# EAGLE design PVScontroller_v1_with_logo (EAGLE 7.2.0)
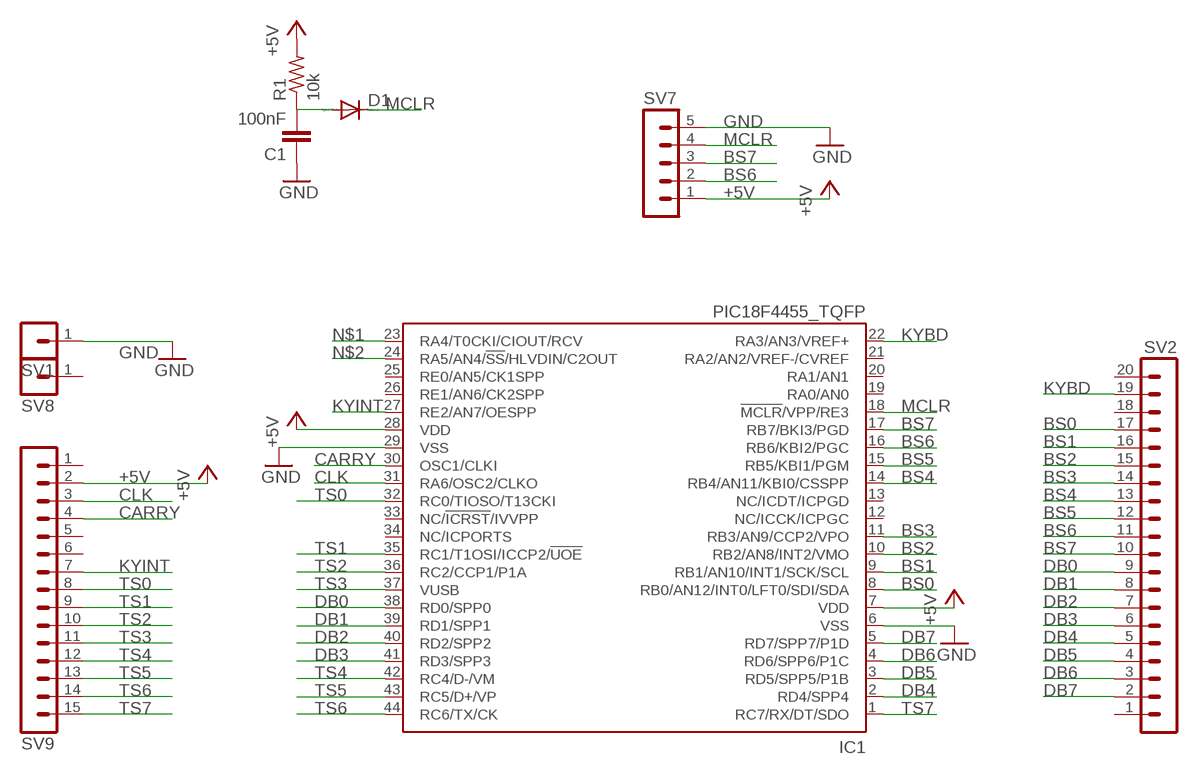
[diagram p0: schematic, sheet 1]

## Parts
C1  100nF  C-EUC0805  [C0805]
D1  DIODE-SOD80C  [SOD80C]
IC1  PIC18F4455_TQFP  [TQFP44]
R1  10k  R-US_R0805  [R0805]
SV1  MA01-1  [MA01-1]
SV2  MA20-1  [MA20-1]
SV7  MA05-1  [MA05-1]
SV8  MA01-1  [MA01-1]
SV9  MA15-1  [MA15-1]

## Nets
+5V: IC1.7(VDD) IC1.28(VDD) R1.2 SV7.1 SV9.2
BS0: IC1.8(RB0/AN12/INT0/LFT0/SDI/SDA) SV2.17
BS1: IC1.9(RB1/AN10/INT1/SCK/SCL) SV2.16
BS2: IC1.10(RB2/AN8/INT2/VMO) SV2.15
BS3: IC1.11(RB3/AN9/CCP2/VPO) SV2.14
BS4: IC1.14(RB4/AN11/KBI0/CSSPP) SV2.13
BS5: IC1.15(RB5/KBI1/PGM) SV2.12
BS6: IC1.16(RB6/KBI2/PGC) SV2.11 SV7.2
BS7: IC1.17(RB7/BKI3/PGD) SV2.10 SV7.3
CARRY: IC1.30(OSC1/CLKI) SV9.4
CLK: IC1.31(RA6/OSC2/CLKO) SV9.3
DB0: IC1.38(RD0/SPP0) SV2.9
DB1: IC1.39(RD1/SPP1) SV2.8
DB2: IC1.40(RD2/SPP2) SV2.7
DB3: IC1.41(RD3/SPP3) SV2.6
DB4: IC1.2(RD4/SPP4) SV2.5
DB5: IC1.3(RD5/SPP5/P1B) SV2.4
DB6: IC1.4(RD6/SPP6/P1C) SV2.3
DB7: IC1.5(RD7/SPP7/P1D) SV2.2
GND: C1.1 IC1.6(VSS) IC1.29(VSS) SV1.1 SV7.5
KYBD: IC1.22(RA3/AN3/VREF+) SV2.19
KYINT: IC1.27(RE2/AN7/OESPP) SV9.7
MCLR: D1.C IC1.18(!MCLR!/VPP/RE3) SV7.4
N$1: IC1.23(RA4/T0CKI/CIOUT/RCV)
N$2: IC1.24(RA5/AN4/!SS!/HLVDIN/C2OUT)
N$4: C1.2 D1.A R1.1
TS0: IC1.32(RC0/TIOSO/T13CKI) SV9.8
TS1: IC1.35(RC1/T1OSI/ICCP2/!UOE) SV9.9
TS2: IC1.36(RC2/CCP1/P1A) SV9.10
TS3: IC1.37(VUSB) SV9.11
TS4: IC1.42(RC4/D-/VM) SV9.12
TS5: IC1.43(RC5/D+/VP) SV9.13
TS6: IC1.44(RC6/TX/CK) SV9.14
TS7: IC1.1(RC7/RX/DT/SDO) SV9.15
Unconnected: IC1.12(NC/ICCK/ICPGC) IC1.13(NC/ICDT/ICPGD) IC1.19(RA0/AN0) IC1.20(RA1/AN1) IC1.21(RA2/AN2/VREF-/CVREF) IC1.25(RE0/AN5/CK1SPP) IC1.26(RE1/AN6/CK2SPP) IC1.33(NC/!ICRST!/IVVPP) IC1.34(NC/ICPORTS) SV2.1 SV2.18 SV2.20 SV8.1 SV9.1 SV9.5 SV9.6

## Library data of the parts
C1 = resistor:C-EU: CAPACITOR, European symbol
D1 = diode:DIODE-: DIODE
IC1 = microchip:PIC18F4*_TQFP: USB Microcontrollers with nanoWatt Technology High-Performance, Enhanced Flash, 28/40/44-Pin, Source: http://ww1.microchip.com/downloads/en/devicedoc/39632c.pdf; MF: MICROCHIP; MPN: PIC18F4455-I/PT; OC_FARNELL: 9321322; OC_NEWARK: 08J9628
R1 = resistor:R-US_: RESISTOR, American symbol
SV1 SV8 = joakim:MA01-1: PIN HEADER
SV2 = joakim:MA20-1: PIN HEADER; OC_FARNELL: unknown; OC_NEWARK: unknown
SV7 = joakim:MA05-1: PIN HEADER; OC_FARNELL: unknown; OC_NEWARK: unknown
SV9 = joakim:MA15-1: PIN HEADER; OC_FARNELL: unknown; OC_NEWARK: unknown

## Board
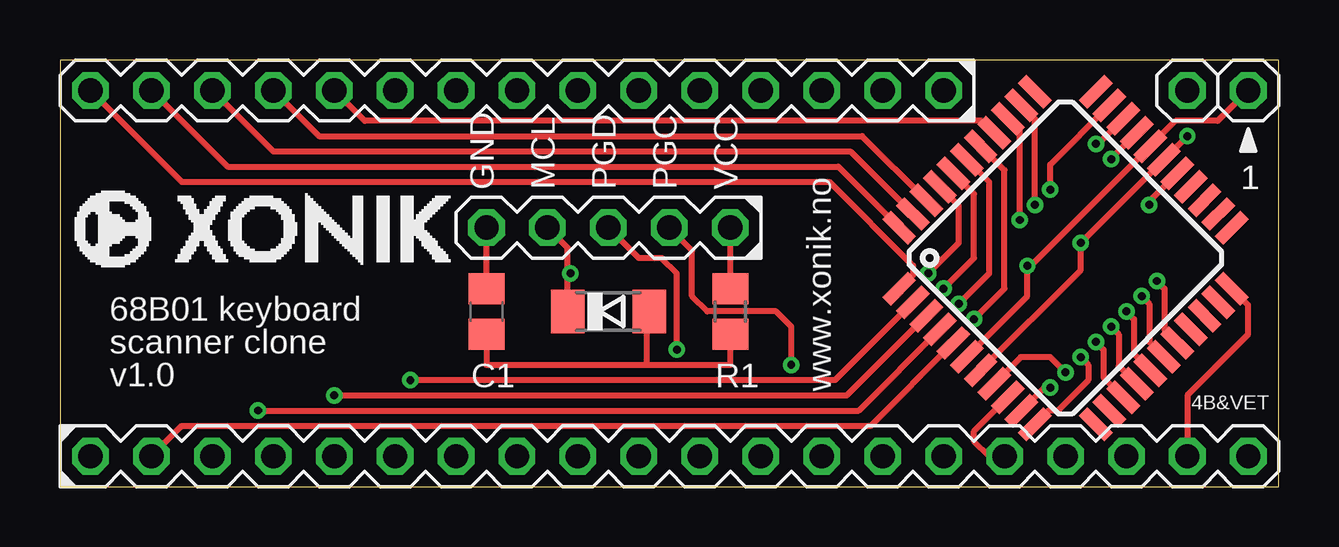
[diagram p1: board, top side]
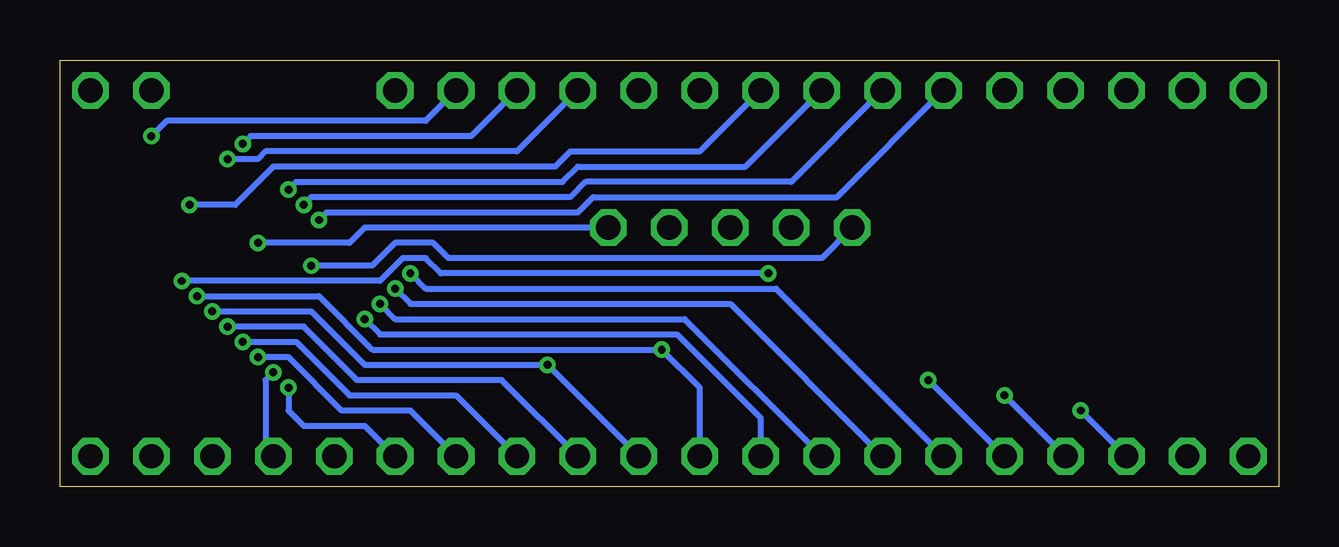
[diagram p2: board, bottom side, seen from below]

Size 50.8 x 17.78 mm. Coordinates in mm from the lower left corner, seen from the top.
Outline: 0,0 50.8,0 50.8,17.78 0,17.78 0,0
Copper layers (1*16): Top 0.0356mm / dielectric 1.5011mm / Bottom 0.0356mm
Design rules "LaenPCBOrder": minimum track width 6mil, minimum drill 13mil, track to track 6mil, track to pad 6mil, pad to pad 6mil, via to via 6mil, smd to smd 6mil, copper to edge 15mil, drill to drill 6mil, minimum pad ring 7mil, minimum via ring 7mil, stop-mask expansion 3mil, vias tented up to drill 0mil, thermal gap 10mil

### Footprints (pad centres in the part's own frame; a part is rotated, then mirrored left to right if it is on the bottom)
C0805 = smd 1.3 x 1.5: 1 -0.95,0; 2 0.95,0
SOD80C = smd 1.4 x 1.8: A 1.7,0; C -1.7,0
TQFP44 = smd 1.5 x 0.5: 1 -5.8,4; 2 -5.8,3.2; 3 -5.8,2.4; 4 -5.8,1.6; 5 -5.8,0.8; 6 -5.8,0; 7 -5.8,-0.8; 8 -5.8,-1.6; 9 -5.8,-2.4; 10 -5.8,-3.2; 11 -5.8,-4; 23 5.8,-4; 24 5.8,-3.2; 25 5.8,-2.4; 26 5.8,-1.6; 27 5.8,-0.8; 28 5.8,0; 29 5.8,0.8; 30 5.8,1.6; 31 5.8,2.4; 32 5.8,3.2; 33 5.8,4 | smd 0.5 x 1.5: 12 -4,-5.8; 13 -3.2,-5.8; 14 -2.4,-5.8; 15 -1.6,-5.8; 16 -0.8,-5.8; 17 0,-5.8; 18 0.8,-5.8; 19 1.6,-5.8; 20 2.4,-5.8; 21 3.2,-5.8; 22 4,-5.8; 34 4,5.8; 35 3.2,5.8; 36 2.4,5.8; 37 1.6,5.8; 38 0.8,5.8; 39 0,5.8; 40 -0.8,5.8; 41 -1.6,5.8; 42 -2.4,5.8; 43 -3.2,5.8; 44 -4,5.8
R0805 = smd 1.3 x 1.5: 1 -0.95,0; 2 0.95,0
MA01-1 = drill 1.016 octagon: 1 0,0
MA20-1 = drill 1.016 octagon: 1 -24.13,0; 2 -21.59,0; 3 -19.05,0; 4 -16.51,0; 5 -13.97,0; 6 -11.43,0; 7 -8.89,0; 8 -6.35,0; 9 -3.81,0; 10 -1.27,0; 11 1.27,0; 12 3.81,0; 13 6.35,0; 14 8.89,0; 15 11.43,0; 16 13.97,0; 17 16.51,0; 18 19.05,0; 19 21.59,0; 20 24.13,0
MA05-1 = drill 1.016 octagon: 1 -5.08,0; 2 -2.54,0; 3 0,0; 4 2.54,0; 5 5.08,0
MA15-1 = drill 1.016 octagon: 1 -17.78,0; 2 -15.24,0; 3 -12.7,0; 4 -10.16,0; 5 -7.62,0; 6 -5.08,0; 7 -2.54,0; 8 0,0; 9 2.54,0; 10 5.08,0; 11 7.62,0; 12 10.16,0; 13 12.7,0; 14 15.24,0; 15 17.78,0

### Placement (x,y rotation side)
C1  17.78,7.3 270 top
D1  22.86,7.3 0 top
IC1  41.91,9.53 45 top
R1  27.94,7.3 90 top
SV1  49.53,16.51 0 top
SV2  25.4,1.27 0 top
SV7  22.86,10.79 180 top
SV8  46.99,16.51 0 top
SV9  19.05,16.51 180 top

### Tracks (layer width: path | path; a pad name or v marks a point on that pad's centre or on a via)
+5V  (via drill 0.33)
  Top 0.254: v46.99,14.61 IC1.28 v42.55,10.16 42.55,9.03 IC1.7 | R1.2 SV7.1
  Bottom 0.254: SV7.1 38.1,10.79 38.73,10.16 v42.55,10.16 | v46.99,14.61 46.35,15.24 35.56,15.24 SV9.2
BS0  (via drill 0.33)
  Top 0.254: v41.91,4.76 41.27,5.4 40.05,5.4 IC1.8
  Bottom 0.254: v41.91,4.76 42.23,4.45 42.23,1.59 SV2.17
BS1
  Top 0.254: IC1.9 38.1,2.32 38.1,1.91 38.73,1.27 SV2.16
BS2  (via drill 0.33)
  Top 0.254: v41.27,4.13 41.04,4.13 IC1.10
  Bottom 0.254: v41.27,4.13 41.27,3.17 40.64,2.54 38.1,2.54 SV2.15
BS3  (via drill 0.33)
  Top 0.254: v42.55,5.4 42.86,5.08 42.86,4.45 41.59,3.17 41.22,3.17 IC1.11
  Bottom 0.254: v42.55,5.4 41.27,5.4 39.05,3.17 36.2,3.17 SV2.14
BS4  (via drill 0.33)
  Top 0.254: v43.18,6.03 43.5,5.71 43.5,4.54 IC1.14
  Bottom 0.254: v43.18,6.03 40.96,6.03 38.73,3.81 34.29,3.81 SV2.13
BS5  (via drill 0.33)
  Top 0.254: v43.81,6.67 44.13,6.35 44.13,5.04 IC1.15
  Bottom 0.254: v43.81,6.67 40.64,6.67 38.42,4.45 32.38,4.45 SV2.12
BS6  (via drill 0.33)
  Top 0.254: v44.45,7.3 44.77,6.99 44.77,5.54 IC1.16 | v30.48,5.08 30.48,6.67 29.84,7.3 26.99,7.3 26.35,7.94 26.35,9.84 SV7.2
  Bottom 0.254: v44.45,7.3 40.32,7.3 38.1,5.08 v30.48,5.08 SV2.11
BS7  (via drill 0.33)
  Top 0.254: v45.09,7.94 45.4,7.62 45.4,6.03 IC1.17 | v25.72,5.71 25.72,8.89 25.08,9.53 24.13,9.53 SV7.3
  Bottom 0.254: v45.09,7.94 40.01,7.94 37.78,5.71 v25.72,5.71 24.13,4.13 SV2.10
CARRY  (via drill 0.33)
  Top 0.254: v43.81,13.65 43.77,13.65 IC1.30
  Bottom 0.254: v43.81,13.65 42.55,13.65 42.23,13.97 31.75,13.97 SV9.4
CLK  (via drill 0.33)
  Top 0.254: v43.18,14.29 43.28,14.29 IC1.31
  Bottom 0.254: v43.18,14.29 42.86,14.61 33.66,14.61 SV9.3
DB0  (via drill 0.33)
  Top 0.254: v38.1,6.99 39.37,8.26 39.37,13.2 IC1.38
  Bottom 0.254: v38.1,6.99 37.47,6.35 25.08,6.35 21.59,2.86 SV2.9
DB1  (via drill 0.33)
  Top 0.254: v37.47,7.62 38.73,8.89 38.73,12.7 IC1.39
  Bottom 0.254: v37.47,7.62 36.83,6.99 24.77,6.99 SV2.8
DB2  (via drill 0.33)
  Top 0.254: v36.83,8.26 38.1,9.53 38.1,12.2 IC1.40
  Bottom 0.254: v36.83,8.26 36.2,7.62 22.86,7.62 SV2.7
DB3  (via drill 0.33)
  Top 0.254: v36.2,8.89 37.47,10.16 37.47,11.71 IC1.41
  Bottom 0.254: v36.2,8.89 35.56,8.26 20.95,8.26 SV2.6
DB4  (via drill 0.33)
  Top 0.254: v14.61,4.45 32.3,4.45 IC1.2
  Bottom 0.254: SV2.5 v14.61,4.45
DB5  (via drill 0.33)
  Top 0.254: v11.43,3.81 32.8,3.81 IC1.3
  Bottom 0.254: SV2.4 v11.43,3.81
DB6  (via drill 0.33)
  Top 0.254: v8.26,3.17 33.3,3.17 IC1.4
  Bottom 0.254: SV2.3 v8.26,3.17
DB7
  Top 0.254: IC1.5 33.79,2.54 5.08,2.54 SV2.2
GND  (via drill 0.33)
  Top 0.254: SV1.1 48.26,15.24 46.49,15.24 IC1.29 40.46,9.21 v40.32,9.21 40.32,7.94 IC1.6 | C1.1 SV7.5
  Bottom 0.254: v40.32,9.21 37.78,9.21 36.83,10.16 35.24,10.16 34.61,9.53 19.05,9.53 SV7.5
KYBD
  Top 0.254: IC1.22 49.53,7.56 49.53,6.35 46.99,3.81 SV2.19
KYINT  (via drill 0.33)
  Top 0.254: v45.4,11.75 45.4,11.89 IC1.27
  Bottom 0.254: v45.4,11.75 43.5,11.75 41.91,13.34 30.16,13.34 29.53,13.97 24.13,13.97 SV9.7
MCLR  (via drill 0.33)
  Top 0.254: v45.72,8.57 46.04,8.26 46.04,6.53 IC1.18 | D1.C 21.16,8.89 | 21.16,8.89 21.16,9.96 SV7.4 | v21.27,8.89 21.16,8.89
  Bottom 0.254: v21.27,8.89 34.92,8.89 35.56,9.53 36.51,9.53 37.47,8.57 v45.72,8.57
N$4
  Top 0.254: C1.2 17.78,5.08 24.45,5.08 | 24.45,5.08 27.94,5.08 R1.1 | D1.A 24.45,6.99 24.45,5.08
TS0  (via drill 0.33)
  Top 0.254: v41.27,12.38 41.27,13.41 IC1.32
  Bottom 0.254: v41.27,12.38 40.96,12.7 29.84,12.7 29.21,13.34 22.23,13.34 SV9.8
TS1  (via drill 0.33)
  Top 0.254: v40.64,11.75 40.64,15.32 IC1.35
  Bottom 0.254: v40.64,11.75 40.32,12.06 29.53,12.06 28.89,12.7 20.32,12.7 SV9.9
TS2  (via drill 0.33)
  Top 0.254: v40.01,11.11 40.01,14.82 IC1.36
  Bottom 0.254: v40.01,11.11 39.69,11.43 29.21,11.43 28.57,12.06 18.41,12.06 SV9.10
TS3
  Top 0.254: IC1.37 38.9,14.76 38.42,15.24 12.7,15.24 SV9.11
TS4
  Top 0.254: IC1.42 33.44,14.61 10.79,14.61 SV9.12
TS5
  Top 0.254: IC1.43 32.94,13.97 8.89,13.97 SV9.13
TS6
  Top 0.254: IC1.44 32.44,13.34 6.99,13.34 SV9.14
TS7
  Top 0.254: IC1.1 35.56,8.83 35.56,9.21 32.07,12.7 5.08,12.7 SV9.15
  Top 0.305: 34.98,8.31 IC1.1

### Text on the board
tPlace: GND | MCL | PGD | PGC | VCC | 1 | 68B01 keyboard | scanner clone | v1.0 | www.xonik.no | 4B&VET